# EasyEDA Pro project bldc_driver_board_easyeda.eprj

# Schematic Schematic1
Create Date: 2024-05-04; Page Name: P1; Project Name: bldc_driver_board_easyeda; Schematic Name: Schematic1; Update Date: 2024-05-07; Company: EasyEDA.com; Drawn: EasyEDA; Page Size: A4; Part Number: JLCPCB-002; Reviewed: EasyEDA; Version: V0.1
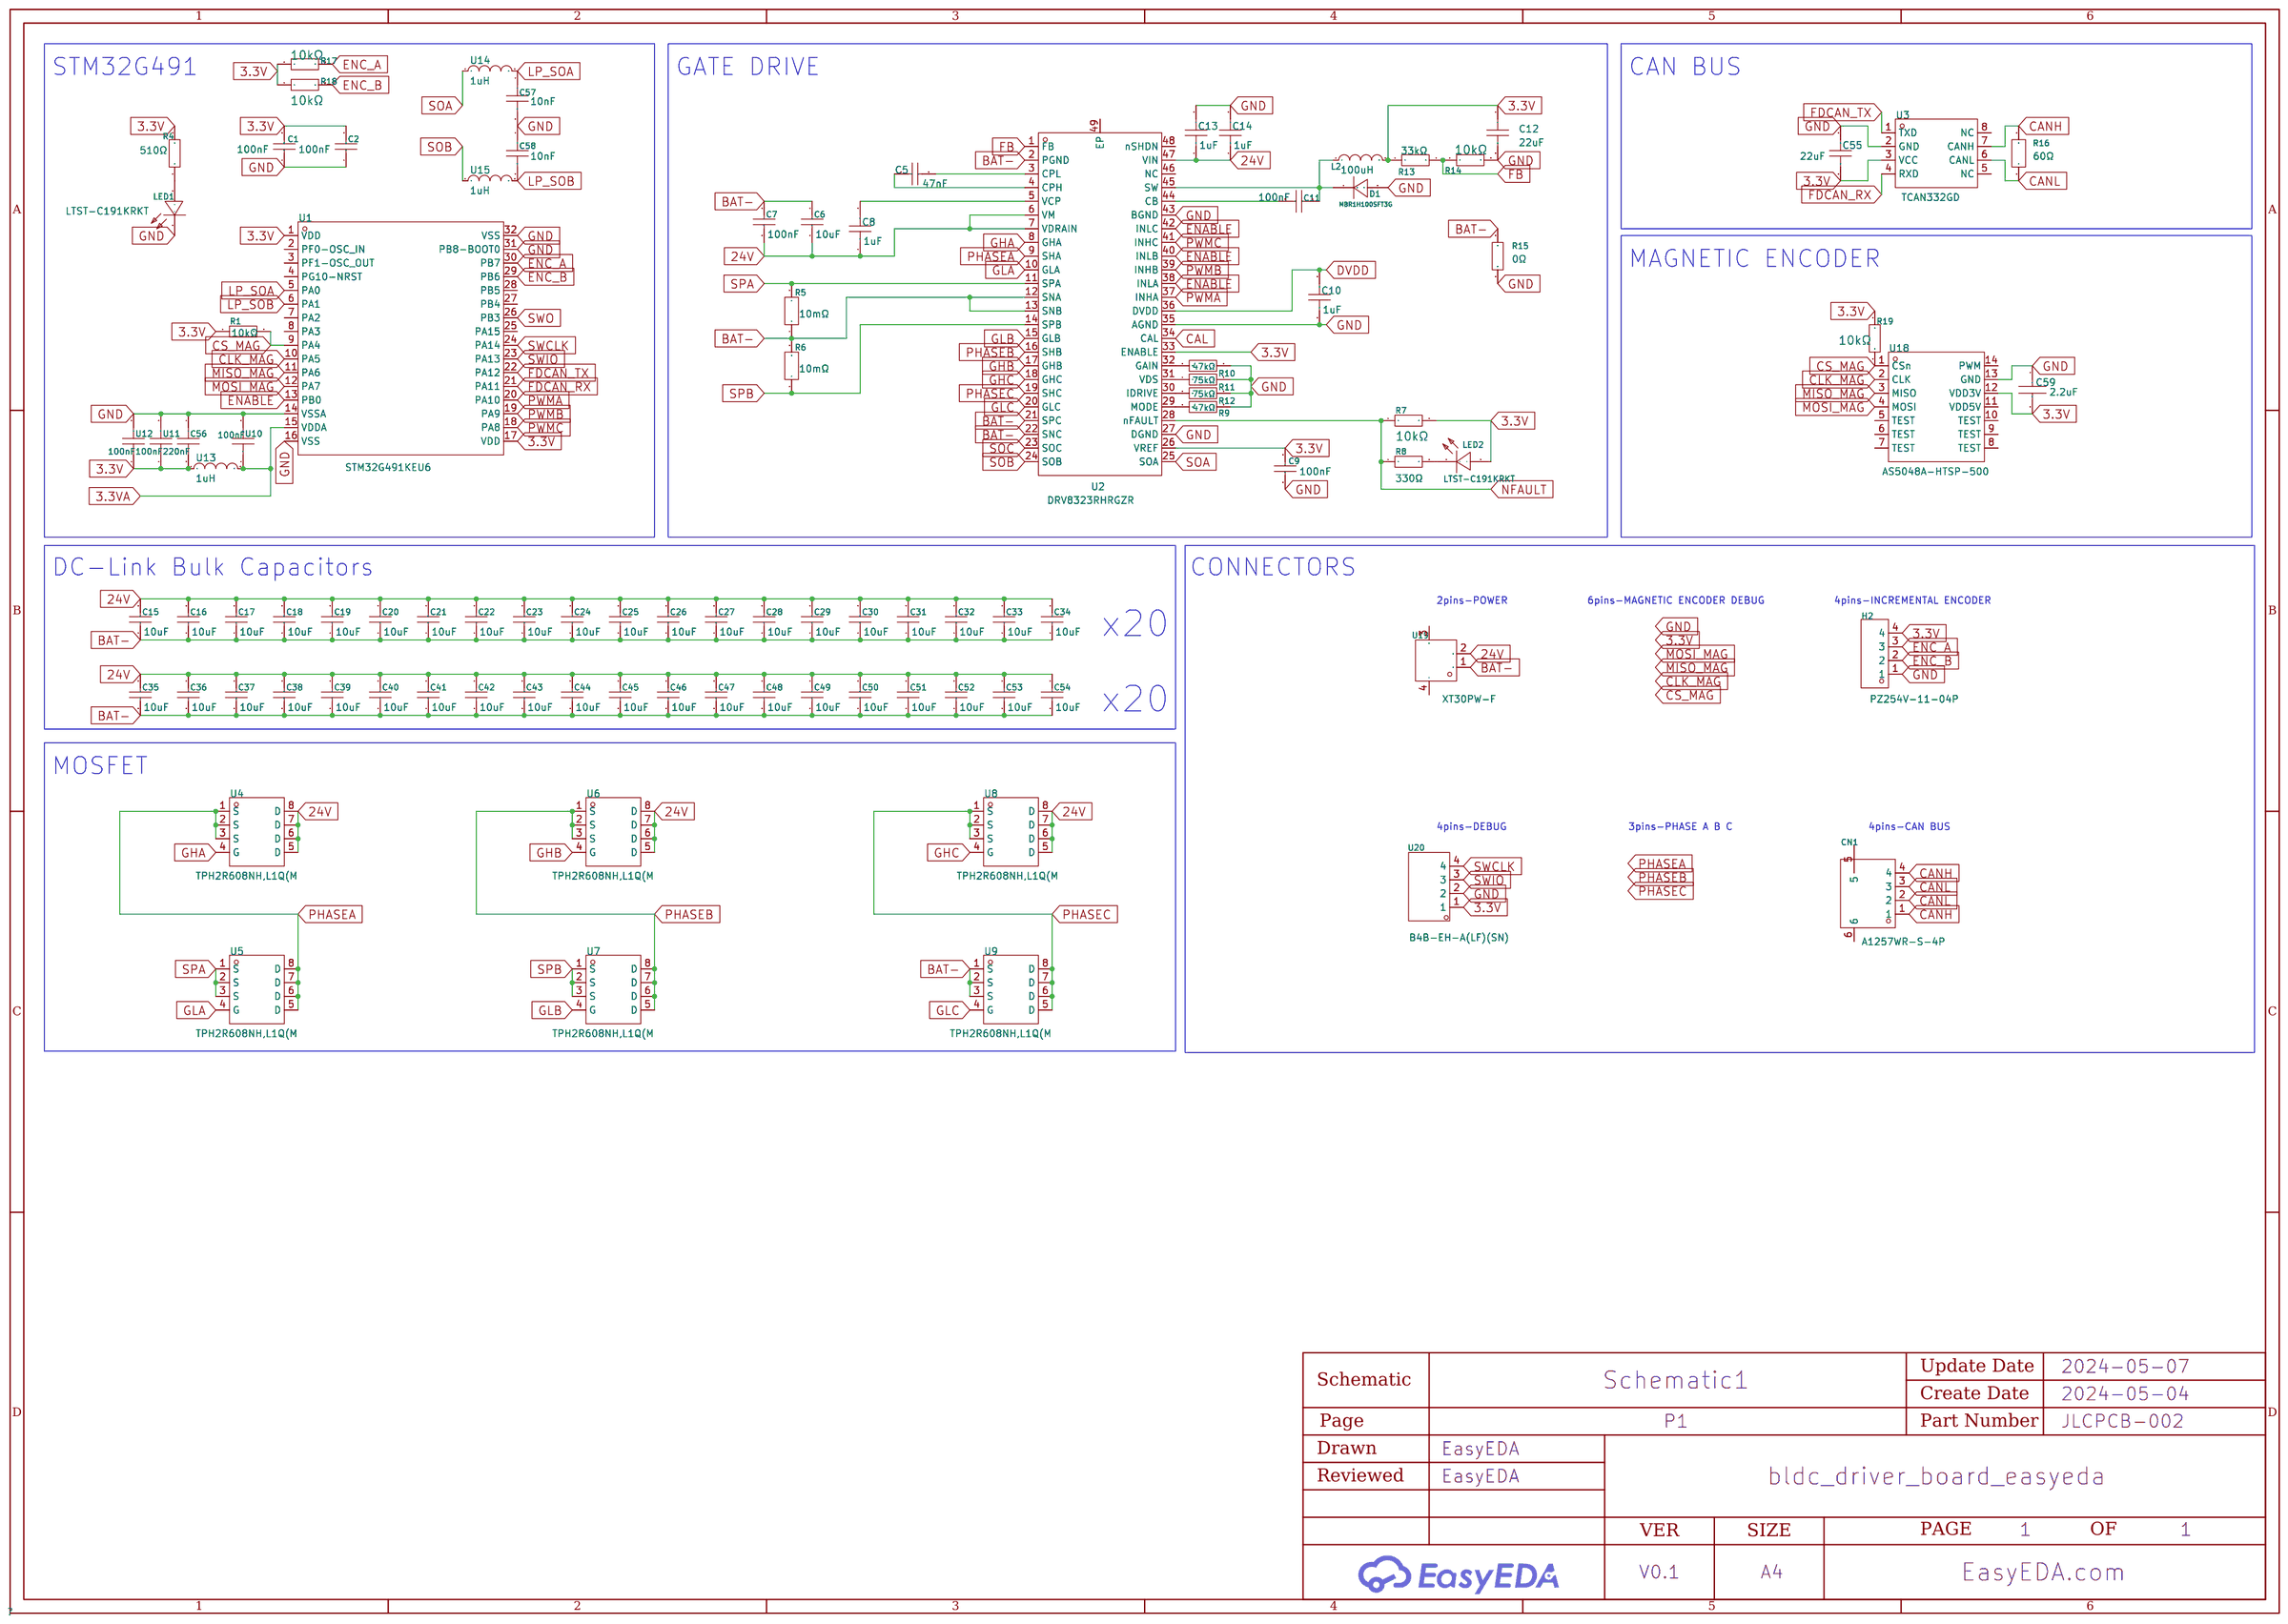
[diagram p0: schematic sheet]

## Parts
C1  100nF  [C0603]
C2  100nF  [C0603]
C5  47nF  [C0805]
C6  10uF  [C1206]
C7  100nF  [C1206]
C8  1uF  [C0603]
C9  100nF  [C0603]
C10  1uF  [C0603]
C11  100nF  [C1206]
C12  22uF  [C0603]
C13  1uF  [C0603]
C14  1uF  [C0603]
C15  10uF  [C1206]
C16  10uF  [C1206]
C17  10uF  [C1206]
C18  10uF  [C1206]
C19  10uF  [C1206]
C20  10uF  [C1206]
C21  10uF  [C1206]
C22  10uF  [C1206]
C23  10uF  [C1206]
C24  10uF  [C1206]
C25  10uF  [C1206]
C26  10uF  [C1206]
C27  10uF  [C1206]
C28  10uF  [C1206]
C29  10uF  [C1206]
C30  10uF  [C1206]
C31  10uF  [C1206]
C32  10uF  [C1206]
C33  10uF  [C1206]
C34  10uF  [C1206]
C35  10uF  [C1206]
C36  10uF  [C1206]
C37  10uF  [C1206]
C38  10uF  [C1206]
C39  10uF  [C1206]
C40  10uF  [C1206]
C41  10uF  [C1206]
C42  10uF  [C1206]
C43  10uF  [C1206]
C44  10uF  [C1206]
C45  10uF  [C1206]
C46  10uF  [C1206]
C47  10uF  [C1206]
C48  10uF  [C1206]
C49  10uF  [C1206]
C50  10uF  [C1206]
C51  10uF  [C1206]
C52  10uF  [C1206]
C53  10uF  [C1206]
C54  10uF  [C1206]
C55  22uF  [C0603]
C56  220nF  [C0201]
C57  10nF  [C01005]
C58  10nF  [C01005]
C59  2.2uF  [C0402]
CN1  A1257WR-S-4P  [CONN-SMD_A1257WR-S-4P]
D1  MBR1H100SFT3G  [SOD-123F_L2.8-W1.8-LS3.7-RD]
H2  PZ254V-11-04P  [HDR-TH_4P-P2.54-V-M]
L2  100uH  [IND-SMD_L4.0-W4.0]
LED1  LTST-C191KRKT  [LED0603-RD]
LED2  LTST-C191KRKT  [LED0603-RD]
R1  10kΩ  [R0603]
R4  510Ω  [R0603]
R5  10mΩ  [RES-SMD_L6.4-W3.2-R2512]
R6  10mΩ  [RES-SMD_L6.4-W3.2-R2512]
R7  10kΩ  [R0603]
R8  330Ω  [R0603]
R9  47kΩ  [R0603]
R10  47kΩ  [R0603]
R11  75kΩ  [R0603]
R12  75kΩ  [R0603]
R13  33kΩ  [R0603]
R14  10kΩ  [R0603]
R15  0Ω  [R1206]
R16  60Ω  [R0603]
R17  10kΩ  [R0603]
R18  10kΩ  [R0603]
R19  10kΩ  [R0603]
U1  STM32G491KEU6  [UFQFPN-32_L5.0-W5.0-P0.50-TL-1]
U2  DRV8323RHRGZR  [VQFN-48_L7.0-W7.0-P0.50-TL-EP5.1]
U3  TCAN332GD  [SOIC-8_L4.9-W3.9-P1.27-LS6.0-BL]
U4  TPH2R608NH,L1Q(M  [POWERVDFN-8_L5.0-W5.0-P1.27-LS6.0-BL]
U5  TPH2R608NH,L1Q(M  [POWERVDFN-8_L5.0-W5.0-P1.27-LS6.0-BL]
U6  TPH2R608NH,L1Q(M  [POWERVDFN-8_L5.0-W5.0-P1.27-LS6.0-BL]
U7  TPH2R608NH,L1Q(M  [POWERVDFN-8_L5.0-W5.0-P1.27-LS6.0-BL]
U8  TPH2R608NH,L1Q(M  [POWERVDFN-8_L5.0-W5.0-P1.27-LS6.0-BL]
U9  TPH2R608NH,L1Q(M  [POWERVDFN-8_L5.0-W5.0-P1.27-LS6.0-BL]
U10  100nF  [C0603]
U11  100nF  [C0603]
U12  100nF  [C0603]
U13  1uH  [L0603]
U14  1uH  [L0603]
U15  1uH  [L0603]
U18  AS5048A-HTSP-500  [TSSOP-14_L5.0-W4.4-P0.65-LS6.4-BL]
U19  XT30PW-F  [CONN-TH_XT30PW-F-1]
U20  B4B-EH-A(LF)(SN)  [CONN-TH_B4B-EH-A-LF-SN]

## Library data of the parts
C1 C2 C9 = CL10B104KO8NNNC: Capacitance: Tolerance:±10% Tolerance:±10% Voltage Rated: Temperature Coefficient:; LCSC Part Name: 100nF ±10% 16V; Supplier Part: C66501; Manufacturer: SAMSUNG(三星); Supplier Footprint: 0603; JLCPCB Part Class: Extended Part; Datasheet: https://atta.szlcsc.com/upload/public/pdf/source/20160218/1457707763339.pdf; Supplier: LCSC; Tolerance: ±10%
C5 = 0805B473K500NT: Capacitance:47nF Tolerance:±10% Tolerance:±10% Voltage Rated: Temperature Coefficient:; LCSC Part Name: 47nF ±10% 50V; Supplier Part: C1745; Manufacturer: FH(风华); Supplier Footprint: 0805; JLCPCB Part Class: Extended Part; Datasheet: https://atta.szlcsc.com/upload/public/pdf/source/20200305/C486355_26A10D38EF8C2A5C37091D0039909270.pdf; Supplier: LCSC; Tolerance: ±10%
C6 C15-C54 = CL31A106KBHNNNE: Capacitance: Tolerance:±10% Tolerance:±10% Voltage Rated: Temperature Coefficient:; LCSC Part Name: 10uF ±10% 50V; Supplier Part: C13585; Manufacturer: SAMSUNG(三星); Supplier Footprint: 1206; JLCPCB Part Class: Basic Part; Datasheet: https://atta.szlcsc.com/upload/public/pdf/source/20160218/1457707763339.pdf; Supplier: LCSC; Tolerance: ±10%
C7 C11 = 1206B104K500NT: Capacitance:100nF Tolerance:±10% Tolerance:±10% Voltage Rated: Temperature Coefficient:; LCSC Part Name: 100nF ±10% 50V; Supplier Part: C110253; Manufacturer: FH(风华); Supplier Footprint: 1206; JLCPCB Part Class: Extended Part; Datasheet: https://atta.szlcsc.com/upload/public/pdf/source/20200305/C486355_26A10D38EF8C2A5C37091D0039909270.pdf; Supplier: LCSC; Tolerance: ±10%
C8 C10 C13 C14 = CL10A105KB8NNNC: Capacitance: Tolerance:±10% Tolerance:±10% Voltage Rated: Temperature Coefficient:; LCSC Part Name: 1uF ±10% 50V; Supplier Part: C15849; Manufacturer: SAMSUNG(三星); Supplier Footprint: 0603; JLCPCB Part Class: Basic Part; Datasheet: https://atta.szlcsc.com/upload/public/pdf/source/20160218/1457707763339.pdf; Supplier: LCSC; Tolerance: ±10%
C12 C55 = CL10A226MQ8NRNE: Capacitance: Tolerance:±20% Tolerance:±20% Voltage Rated: Temperature Coefficient:; LCSC Part Name: 22uF ±20% 6.3V; Supplier Part: C159801; Manufacturer: SAMSUNG(三星); Supplier Footprint: 0603; JLCPCB Part Class: Extended Part; Datasheet: https://atta.szlcsc.com/upload/public/pdf/source/20160218/1457707763339.pdf; Supplier: LCSC; Tolerance: ±20%
C56 = C0603X5R0J224KT00NN: Capacitance: Tolerance:±10% Tolerance:±10% Voltage Rated: Temperature Coefficient:; LCSC Part Name: 220nF ±10% 6.3V; Supplier Part: C338049; Manufacturer: TDK; Supplier Footprint: 0201; JLCPCB Part Class: Extended Part; Datasheet: https://atta.szlcsc.com/upload/public/pdf/source/20190322/C361206_9C300BFAC6DE9FB712DF280041B5B925.pdf; Supplier: LCSC; Tolerance: ±10%
C57 C58 = CC0100KRX5R5BB103: Capacitance: Tolerance:±10% Tolerance:±10% Voltage Rated: Temperature Coefficient:; LCSC Part Name: 10nF ±10% 6.3V; Supplier Part: C326959; Manufacturer: YAGEO(国巨); Supplier Footprint: 01005; JLCPCB Part Class: Extended Part; Datasheet: https://atta.szlcsc.com/upload/public/pdf/source/20181031/C326959_7F573BD42856BB1A942F621CBEE8E6B0.pdf; Supplier: LCSC; Tolerance: ±10%
C59 = CL05A225MQ5NSNC: Capacitance: Tolerance:±20% Tolerance:±20% Voltage Rated: Temperature Coefficient:; LCSC Part Name: 2.2uF ±20% 6.3V; Supplier Part: C12530; Manufacturer: SAMSUNG(三星); Supplier Footprint: 0402; JLCPCB Part Class: Basic Part; Datasheet: https://atta.szlcsc.com/upload/public/pdf/source/20160218/1457707763339.pdf; Supplier: LCSC; Tolerance: ±20%
CN1 = A1257WR-S-4P: Pins Structure:1x4P Pitch:1.25mm Mounting Style:- Reference Series:GH Number of Pins:4P Number of Rows:1 Number of PINs Per Row:4 Row Spacing:- Contact Material:Brass; LCSC Part Name: 系列:GH 间距:1.25mm 1x4P; Supplier Part: C225127; Manufacturer: CJT(长江连接器); Supplier Footprint: SMD,P=1.25mm; JLCPCB Part Class: Extended Part; Datasheet: https://atta.szlcsc.com/upload/public/pdf/source/20181008/C272994_C9E89FA8A36D0009CAD30AD8C59C2782.pdf; Supplier: LCSC; Pins Structure: 1x4P; Pitch: 1.25mm; Reference Series: GH; Number of Pins: 4P; Number of Rows: 1; Number of PINs Per Row: 4; Contact Material: Brass
D1 = MBR1H100SFT3G: Forward Voltage (Vf@If):760mV@1A Reverse Voltage (Vr):100V Average Rectified Current (Io):1A Reverse Leakage Current (Ir):40uA@100V; LCSC Part Name: 电压:100V 电流:1A; Supplier Part: C235757; Manufacturer: onsemi(安森美); Supplier Footprint: SOD-123FL; JLCPCB Part Class: Extended Part; Datasheet: https://atta.szlcsc.com/upload/public/pdf/source/20221020/1153CD973F1751438771FE3485A9D615.pdf; Supplier: LCSC; Forward Voltage (Vf@If): 760mV@1A; Reverse Voltage (Vr): 100V; Average Rectified Current (Io): 1A; Reverse Leakage Current (Ir): 40uA@100V
H2 = PZ254V-11-04P_C492403: Pin Structure:1x4P Pitch:2.54mm Row Spacing:- Circluar Pins/Square Pins:Square Pins Mounting Type:Straight Number of Rows:Plugin Number of Pins:4P Current Rating (Max):- Voltage Rating (Max):- Length of Mating Pin:6mm Insulation Height:2.5mm Length of End; LCSC Part Name: 间距:2.54mm 1x4P 直插 方针; Supplier Part: C492403; Manufacturer: XFCN(兴飞); Supplier Footprint: 插件,P=2.54mm; JLCPCB Part Class: Extended Part; Datasheet: https://atta.szlcsc.com/upload/public/pdf/source/20200309/C492403_F9F19131791D08044AD4F84F8E751A34.pdf; Supplier: LCSC; Pin Structure: 1x4P; Pitch: 2.54mm; Circluar Pins/Square Pins: Square Pins; Mounting Type: Straight; Number of Rows: Plugin; Number of Pins: 4P; Length of Mating Pin: 6mm; Insulation Height: 2.5mm; Length of End Connection Pin: 3mm; Operating Temperature Range: -40℃~+105℃; Color: Black
L2 = ASPIAIG-S4035-101M-T: Inductance:100uH Tolerance:±20% Tolerance:±20% Rated Current: Saturation Current (Isat):750mA DC Resistance (DCR): Ratings:AEC-Q200; LCSC Part Name: 100uH ±20% 750mA; Supplier Part: C1334632; Manufacturer: ABRACON; Supplier Footprint: SMD,4x4mm; JLCPCB Part Class: Extended Part; Datasheet: https://atta.szlcsc.com/upload/public/pdf/source/20210702/86CE89ECC75CFDE29082610D72370976.pdf; Supplier: LCSC; Tolerance: ±20%; Saturation Current (Isat): 750mA; Ratings: AEC-Q200
LED1 LED2 = LTST-C191KRKT: Emitted Color:Red Forward Voltage (VF):2V Forward Voltage (VF):2V Power Dissipation:75mW Forward Current:20mA Dominant Wavelength:631nm Dominant Wavelength:631nm Peak Wavelength:639nm Diode Configuration:- Lens Color:无色透明透镜 Color Temperature:- Color Tempe; LCSC Part Name: 红灯; Supplier Part: C125099; Manufacturer: LITEON(光宝); Supplier Footprint: 0603; JLCPCB Part Class: Extended Part; Datasheet: https://atta.szlcsc.com/upload/public/pdf/source/20180129/C125099_15171878294931315872.pdf; Supplier: LCSC; Emitted Color: Red; Forward Voltage (VF): 2V; Power Dissipation: 75mW; Forward Current: 20mA; Dominant Wavelength: 631nm; Peak Wavelength: 639nm; Lens Color: 无色透明透镜; Luminous Intensity: 54mcd; Viewing Angle: 130°; Operating Temperature: -55℃~+85℃
R1 R7 R14 R17-R19 = 0603WAF1002T5E: Type:Thick Film Resistors Resistance:10kΩ Tolerance:±1% Tolerance:±1% Power(Watts): Overload Voltage (Max): Temperature Coefficient:±100ppm/℃ Temperature Coefficient:±100ppm/℃ Operating Temperature Range:-55℃~+155℃ Operating Temperature Range:-55℃~+155℃; LCSC Part Name: 厚膜电阻 10kΩ ±1% 100mW; Supplier Part: C25804; Manufacturer: UNI-ROYAL(厚声); Supplier Footprint: 0603; JLCPCB Part Class: Basic Part; Datasheet: https://atta.szlcsc.com/upload/public/pdf/source/20200306/C422600_1E6D84923E4A46A82E41ADD87F860B5C.pdf; Supplier: LCSC; Type: Thick Film Resistors; Tolerance: ±1%; Temperature Coefficient: ±100ppm/℃; Operating Temperature Range: -55℃~+155℃
R4 = 0603WAF5100T5E: Type:Thick Film Resistors Resistance: Tolerance:±1% Tolerance:±1% Power(Watts): Overload Voltage (Max): Temperature Coefficient:±100ppm/℃ Temperature Coefficient:±100ppm/℃ Operating Temperature Range:-55℃~+155℃ Operating Temperature Range:-55℃~+155℃; LCSC Part Name: 510Ω ±1% 100mW 厚膜电阻; Supplier Part: C23193; Manufacturer: UNI-ROYAL(厚声); Supplier Footprint: 0603; JLCPCB Part Class: Basic Part; Datasheet: https://atta.szlcsc.com/upload/public/pdf/source/20200306/C422600_1E6D84923E4A46A82E41ADD87F860B5C.pdf; Supplier: LCSC; Type: Thick Film Resistors; Tolerance: ±1%; Temperature Coefficient: ±100ppm/℃; Operating Temperature Range: -55℃~+155℃
R5 R6 = HoJLR2512-3W-10mR-1%: Type:Current Sensing Resistors Resistance:10mΩ Tolerance:±1% Tolerance:±1% Power(Watts): Mounting Sytle:Surface Mount; LCSC Part Name: 10mΩ ±1% 3W; Supplier Part: C2903468; Manufacturer: Milliohm(毫欧); Supplier Footprint: 2512; JLCPCB Part Class: Extended Part; Datasheet: https://atta.szlcsc.com/upload/public/pdf/source/20211009/7525CABAB363C979E942C1DD41F1FEF0.pdf; Supplier: LCSC; Type: Current Sensing Resistors; Tolerance: ±1%; Mounting Sytle: Surface Mount
R8 = 0603WAF3300T5E: Type:Thick Film Resistors Resistance: Tolerance:±1% Tolerance:±1% Power(Watts): Overload Voltage (Max): Temperature Coefficient:±100ppm/℃ Temperature Coefficient:±100ppm/℃ Operating Temperature Range:-55℃~+155℃ Operating Temperature Range:-55℃~+155℃; LCSC Part Name: 330Ω ±1% 100mW 厚膜电阻; Supplier Part: C23138; Manufacturer: UNI-ROYAL(厚声); Supplier Footprint: 0603; JLCPCB Part Class: Basic Part; Datasheet: https://atta.szlcsc.com/upload/public/pdf/source/20200306/C422600_1E6D84923E4A46A82E41ADD87F860B5C.pdf; Supplier: LCSC; Type: Thick Film Resistors; Tolerance: ±1%; Temperature Coefficient: ±100ppm/℃; Operating Temperature Range: -55℃~+155℃
R9 R10 = 0603WAF4702T5E: Type:Thick Film Resistors Resistance:47kΩ Tolerance:±1% Tolerance:±1% Power(Watts): Overload Voltage (Max): Temperature Coefficient:±100ppm/℃ Temperature Coefficient:±100ppm/℃ Operating Temperature Range:-55℃~+155℃ Operating Temperature Range:-55℃~+155℃; LCSC Part Name: 47kΩ ±1% 100mW 厚膜电阻; Supplier Part: C25819; Manufacturer: UNI-ROYAL(厚声); Supplier Footprint: 0603; JLCPCB Part Class: Basic Part; Datasheet: https://atta.szlcsc.com/upload/public/pdf/source/20200306/C422600_1E6D84923E4A46A82E41ADD87F860B5C.pdf; Supplier: LCSC; Type: Thick Film Resistors; Tolerance: ±1%; Temperature Coefficient: ±100ppm/℃; Operating Temperature Range: -55℃~+155℃
R11 R12 = 0603WAF7502T5E: Type:Thick Film Resistors Resistance:75kΩ Tolerance:±1% Tolerance:±1% Power(Watts): Overload Voltage (Max): Temperature Coefficient:±100ppm/℃ Temperature Coefficient:±100ppm/℃ Operating Temperature Range:-55℃~+155℃ Operating Temperature Range:-55℃~+155℃; LCSC Part Name: 75kΩ ±1% 100mW 厚膜电阻; Supplier Part: C23242; Manufacturer: UNI-ROYAL(厚声); Supplier Footprint: 0603; JLCPCB Part Class: Basic Part; Datasheet: https://atta.szlcsc.com/upload/public/pdf/source/20200306/C422600_1E6D84923E4A46A82E41ADD87F860B5C.pdf; Supplier: LCSC; Type: Thick Film Resistors; Tolerance: ±1%; Temperature Coefficient: ±100ppm/℃; Operating Temperature Range: -55℃~+155℃
R13 = 0603WAF3302T5E: Type:Thick Film Resistors Resistance:33kΩ Tolerance:±1% Tolerance:±1% Power(Watts): Overload Voltage (Max): Temperature Coefficient:±100ppm/℃ Temperature Coefficient:±100ppm/℃ Operating Temperature Range:-55℃~+155℃ Operating Temperature Range:-55℃~+155℃; LCSC Part Name: 33kΩ ±1% 100mW 厚膜电阻; Supplier Part: C4216; Manufacturer: UNI-ROYAL(厚声); Supplier Footprint: 0603; JLCPCB Part Class: Basic Part; Datasheet: https://atta.szlcsc.com/upload/public/pdf/source/20200306/C422600_1E6D84923E4A46A82E41ADD87F860B5C.pdf; Supplier: LCSC; Type: Thick Film Resistors; Tolerance: ±1%; Temperature Coefficient: ±100ppm/℃; Operating Temperature Range: -55℃~+155℃
R15 = 1206W4F0000T5E: Type:Thick Film Resistors Resistance: Tolerance:±1% Tolerance:±1% Power(Watts): Overload Voltage (Max): Temperature Coefficient:±800ppm/℃ Temperature Coefficient:±800ppm/℃ Operating Temperature Range:-55℃~+155℃ Operating Temperature Range:-55℃~+155℃; LCSC Part Name: 0Ω ±1% 250mW 厚膜电阻; Supplier Part: C17888; Manufacturer: UNI-ROYAL(厚声); Supplier Footprint: 1206; JLCPCB Part Class: Basic Part; Datasheet: https://atta.szlcsc.com/upload/public/pdf/source/20200306/C422600_1E6D84923E4A46A82E41ADD87F860B5C.pdf; Supplier: LCSC; Type: Thick Film Resistors; Tolerance: ±1%; Temperature Coefficient: ±800ppm/℃; Operating Temperature Range: -55℃~+155℃
R16 = RTT0360R0FTP: Type:Thick Film Resistors Resistance: Tolerance:±1% Tolerance:±1% Power(Watts): Overload Voltage (Max): Temperature Coefficient:±100ppm/℃ Temperature Coefficient:±100ppm/℃ Operating Temperature Range:-55℃~+155℃ Operating Temperature Range:-55℃~+155℃; LCSC Part Name: 厚膜电阻 60Ω ±1% 100mW; Supplier Part: C166918; Manufacturer: RALEC(旺诠); Supplier Footprint: 0603; JLCPCB Part Class: Extended Part; Datasheet: https://atta.szlcsc.com/upload/public/pdf/source/20180928/C303758_52AE496EA05AD4D633595C32F5A0EBAF.pdf; Supplier: LCSC; Type: Thick Film Resistors; Tolerance: ±1%; Temperature Coefficient: ±100ppm/℃; Operating Temperature Range: -55℃~+155℃
U1 = STM32G491KEU6: CPU Core:- Program Storage Size:512KB GPIO Ports Number:26 Operating Voltage Range:1.71V~3.6V Operating Voltage Range:1.71V~3.6V CPU Maximum Speed:170MHz Operating Temperature Range:-40℃~+85℃ Operating Temperature Range:-40℃~+85℃ ADC (Bit):12bit DAC (Bit); Supplier Part: C3225629; Manufacturer: ST(意法半导体); Supplier Footprint: UFQFPN-32(5x5); JLCPCB Part Class: Extended Part; Datasheet: https://atta.szlcsc.com/upload/public/pdf/source/20221107/0005850207A0EC94E09E1AFE17A81C39.pdf; Supplier: LCSC; Program Storage Size: 512KB; GPIO Ports Number: 26; Operating Voltage Range: 1.71V~3.6V; CPU Maximum Speed: 170MHz; Operating Temperature Range: -40℃~+85℃; ADC (Bit): 12bit; DAC (Bit): 12bit; Universal Serial Bus: 有; Watchdog: 有; Infrared Data Association: 有; Low-Voltage Detect: 有; Direct Memory Access: 有; Internal Oscillator: 有
U2 = DRV8323RHRGZR: Supply Voltage:6V~60V Supply Voltage:6V~60V Operating Temperature:-40℃~+125℃@(Ta) Operating Temperature:-40℃~+125℃@(Ta); Supplier Part: C543035; Manufacturer: TI(德州仪器); Supplier Footprint: VQFN-48-EP(7x7); JLCPCB Part Class: Extended Part; Datasheet: https://www.ti.com/cn/lit/gpn/drv8323r; Supplier: LCSC; Supply Voltage: 6V~60V; Operating Temperature: -40℃~+125℃@(Ta)
U3 = TCAN332GD: Type:Transceiver Data Rate:5Mbps Supply Voltage:3V~3.6V Supply Voltage:3V~3.6V Operating Temperature:-40℃~+125℃ Operating Temperature:-40℃~+125℃; Supplier Part: C1545625; Manufacturer: TI(德州仪器); Supplier Footprint: SOIC-8; JLCPCB Part Class: Extended Part; Datasheet: https://www.ti.com/cn/lit/gpn/tcan332; Supplier: LCSC; Type: Transceiver; Data Rate: 5Mbps; Supply Voltage: 3V~3.6V; Operating Temperature: -40℃~+125℃
U4-U9 = TPH2R608NH,L1Q(M: Supplier Part: C5379811; Manufacturer: TOSHIBA(东芝); Supplier Footprint: SOP-8; Datasheet: https://atta.szlcsc.com/upload/public/pdf/source/20230606/A43572E280778E6E932BD69F3356FB0D.pdf; Supplier: LCSC
U10-U12 = 06036D104KAT2A: Capacitance: Tolerance:±10% Tolerance:±10% Voltage Rated: Temperature Coefficient:; LCSC Part Name: 100nF ±10% 6.3V; Supplier Part: C1856510; Manufacturer: Kyocera AVX; Supplier Footprint: 0603; JLCPCB Part Class: Extended Part; Datasheet: https://atta.szlcsc.com/upload/public/pdf/source/20210630/E771284EE21E0F270718F23EFAB9C321.pdf; Supplier: LCSC; Tolerance: ±10%
U13-U15 = YL160808-1R0K: Inductance: Tolerance:±10% Tolerance:±10% Rated Current: Saturation Current (Isat):- DC Resistance (DCR): Q @ Freq:35@10MHz Frequency - Self Resonant: Ratings:; LCSC Part Name: 1uH ±10%; Supplier Part: C2839970; Manufacturer: YJYCOIN(益嘉源); Supplier Footprint: 0603; JLCPCB Part Class: Extended Part; Datasheet: https://atta.szlcsc.com/upload/public/pdf/source/20210615/C2839970_ABC794F14AEDE076178322CDBBF81D48.pdf; Supplier: LCSC; Tolerance: ±10%; Q @ Freq: 35@10MHz
U18 = AS5048A-HTSP-500: Supply Voltage:3V~3.6V；4.5V~5.5V Supply Voltage:3V~3.6V；4.5V~5.5V Rotation Angle:0°~360° Rotation Angle:0°~360°; Supplier Part: C2655181; Manufacturer: ams(艾迈斯半导体); Supplier Footprint: TSSOP-14; JLCPCB Part Class: Extended Part; Datasheet: https://atta.szlcsc.com/upload/public/pdf/source/20210429/095640A91DD735A5214A8BC6EE68F312.pdf; Supplier: LCSC; Supply Voltage: 3V~3.6V；4.5V~5.5V; Rotation Angle: 0°~360°
U19 = XT30PW-F: Brand:艾迈斯 Model:XT30PW-F Power:- Output:- Input:- Size:- Interface:- Type:- Colour:- MaximumCurrent:- Type:航模插头 RatedVoltage:- Type1:- NumberOfUSBHoles:- InterfaceType:母头 MetalMaterial:- InsulationMaterial:- RatedCurrent:- RecommendedWireGauge:- FlameReta; LCSC Part Name: AMASS(艾迈斯)电源连接器 母头 XT30PW-F; Supplier Part: C2913282; Manufacturer: AMASS(艾迈斯); JLCPCB Part Class: Extended Part; Datasheet: https://atta.szlcsc.com/upload/public/pdf/source/20231218/06CFCF98887A9A87638B0856A725C8FD.pdf; Supplier: LCSC; Brand: 艾迈斯; Type: 航模插头; InterfaceType: 母头
U20 = B4B-EH-A(LF)(SN): Pins Structure:1x4P Pitch:2.5mm Mounting Style:- Reference Series:EH Number of Pins:4P Number of Rows:1 Number of PINs Per Row:4 Row Spacing:- Contact Material:Brass; Supplier Part: C160258; Manufacturer: JST; Supplier Footprint: 插件,P=2.5mm; JLCPCB Part Class: Extended Part; Datasheet: https://atta.szlcsc.com/upload/public/pdf/source/20180829/C265103_11C5AD83FCD48B5E904586D0E75EE570.pdf; Supplier: LCSC; Pins Structure: 1x4P; Pitch: 2.5mm; Reference Series: EH; Number of Pins: 4P; Number of Rows: 1; Number of PINs Per Row: 4; Contact Material: Brass

## Nets
3.3V: C1.2 C2.2 C9.2 C12.1 C55.2 C56.2 C59.2 H2.4 L2.2 LED2.2(+) R1.1 R4.2 R7.2 R13.1 R17.1 R18.1 R19.2 U1.1(VDD) U1.17(VDD) U2.26(VREF) U2.33(ENABLE) U3.3(VCC) U11.1 U12.1 U13.1 U18.12(VDD3V) U20.1
3.3VA: U1.15(VDDA) U10.1 U13.2
24V: C6.1 C7.1 C8.1 C13.1 C14.1 C15.2 C16.2 C17.2 C18.2 C19.2 C20.2 C21.2 C22.2 C23.2 C24.2 C25.2 C26.2 C27.2 C28.2 C29.2 C30.2 C31.2 C32.2 C33.2 C34.2 C35.2 C36.2 C37.2 C38.2 C39.2 C40.2 C41.2 C42.2 C43.2 C44.2 C45.2 C46.2 C47.2 C48.2 C49.2 C50.2 C51.2 C52.2 C53.2 C54.2 U2.6(VM) U2.7(VDRAIN) U2.47(VIN) U4.5(D) U4.6(D) U4.7(D) U4.8(D) U6.5(D) U6.6(D) U6.7(D) U6.8(D) U8.5(D) U8.6(D) U8.7(D) U8.8(D) U19.2
DVDD: C10.2 U2.36(DVDD)
GND: C1.1 C2.1 C9.1 C10.1 C12.2 C13.2 C14.2 C55.1 C56.1 C57.2 C58.1 C59.1 D1.2(A) H2.1 LED1.1(-) R9.2 R10.2 R11.2 R12.2 R14.2 R15.1 U1.14(VSSA) U1.16(VSS) U1.31(PB8-BOOT0) U1.32(VSS) U2.27(DGND) U2.35(AGND) U2.43(BGND) U3.2(GND) U10.2 U11.2 U12.2 U18.13(GND) U20.2
BAT-: C6.2 C7.2 C15.1 C16.1 C17.1 C18.1 C19.1 C20.1 C21.1 C22.1 C23.1 C24.1 C25.1 C26.1 C27.1 C28.1 C29.1 C30.1 C31.1 C32.1 C33.1 C34.1 C35.1 C36.1 C37.1 C38.1 C39.1 C40.1 C41.1 C42.1 C43.1 C44.1 C45.1 C46.1 C47.1 C48.1 C49.1 C50.1 C51.1 C52.1 C53.1 C54.1 R5.1 R6.2 R15.2 U2.2(PGND) U2.12(SNA) U2.13(SNB) U2.21(SPC) U2.22(SNC) U9.1(S) U9.2(S) U9.3(S) U19.1
CAL: U2.34(CAL)
CANH: CN1.1 CN1.4 R16.2 U3.7(CANH)
CANL: CN1.2 CN1.3 R16.1 U3.6(CANL)
CLK_MAG: U1.10(PA5) U18.2(CLK)
CS_MAG: R1.2 R19.1 U1.9(PA4) U18.1(CSn)
ENABLE: U1.13(PB0) U2.38(INLA) U2.40(INLB) U2.42(INLC)
ENC_A: H2.3 R17.2 U1.30(PB7)
ENC_B: H2.2 R18.2 U1.29(PB6)
FB: R13.2 R14.1 U2.1(FB)
FDCAN_RX: U1.21(PA11) U3.4(RXD)
FDCAN_TX: U1.22(PA12) U3.1(TXD)
GHA: U2.8(GHA) U4.4(G)
GHB: U2.17(GHB) U6.4(G)
GHC: U2.18(GHC) U8.4(G)
GLA: U2.10(GLA) U5.4(G)
GLB: U2.15(GLB) U7.4(G)
GLC: U2.20(GLC) U9.4(G)
LP_SOA: C57.1 U1.5(PA0) U14.2
LP_SOB: C58.2 U1.6(PA1) U15.2
MISO_MAG: U1.11(PA6) U18.3(MISO)
MOSI_MAG: U1.12(PA7) U18.4(MOSI)
NFAULT: R7.1 R8.1 U2.28(nFAULT)
PHASEA: U2.9(SHA) U4.1(S) U4.2(S) U4.3(S) U5.5(D) U5.6(D) U5.7(D) U5.8(D)
PHASEB: U2.16(SHB) U6.1(S) U6.2(S) U6.3(S) U7.5(D) U7.6(D) U7.7(D) U7.8(D)
PHASEC: U2.19(SHC) U8.1(S) U8.2(S) U8.3(S) U9.5(D) U9.6(D) U9.7(D) U9.8(D)
PWMA: U1.20(PA10) U2.37(INHA)
PWMB: U1.19(PA9) U2.39(INHB)
PWMC: U1.18(PA8) U2.41(INHC)
SOA: U2.25(SOA) U14.1
SOB: U2.24(SOB) U15.1
SOC: U2.23(SOC)
SPA: R5.2 U2.11(SPA) U5.1(S) U5.2(S) U5.3(S)
SPB: R6.1 U2.14(SPB) U7.1(S) U7.2(S) U7.3(S)
SWCLK: U1.24(PA14) U20.4
SWIO: U1.23(PA13) U20.3
SWO: U1.26(PB3)
$1N3020: LED1.2(+) R4.1
$1N3116: C5.2 U2.3(CPL)
$1N3119: C5.1 U2.4(CPH)
$1N3348: C8.2 U2.5(VCP)
$1N4267: LED2.1(-) R8.2
$1N4347: R9.1 U2.29(MODE)
$1N4386: R10.1 U2.32(GAIN)
$1N4470: R11.1 U2.31(VDS)
$1N4546: R12.1 U2.30(IDRIVE)
$1N4795: C11.2 U2.44(CB)
$1N4956: C11.1 D1.1(C) L2.1 U2.45(SW)

Not connected (* = marked no-connect by the designer): CN1 5 6; U1 2(PF0-OSC_IN) 3(PF1-OSC_OUT) 4(PG10-NRST) 7(PA2) 8(PA3) 25(PA15) 27(PB4) 28(PB5); U2 46(NC) 48(nSHDN) 49(EP); U3 5(NC) 8(NC); U18 5(TEST) 6(TEST) 7(TEST) 8(TEST) 9(TEST) 10(TEST) 11(VDD5V) 14(PWM); U19 3 4

## Notes on the sheet
- STM32G491
- GATE DRIVE
- CAN BUS
- MAGNETIC ENCODER
- DC-Link Bulk Capacitors
- CONNECTORS
- 2pins-POWER
- 6pins-MAGNETIC ENCODER DEBUG
- 4pins-INCREMENTAL ENCODER
- x20
- x20
- MOSFET
- 4pins-DEBUG
- 3pins-PHASE A B C
- 4pins-CAN BUS

# Board PCB3
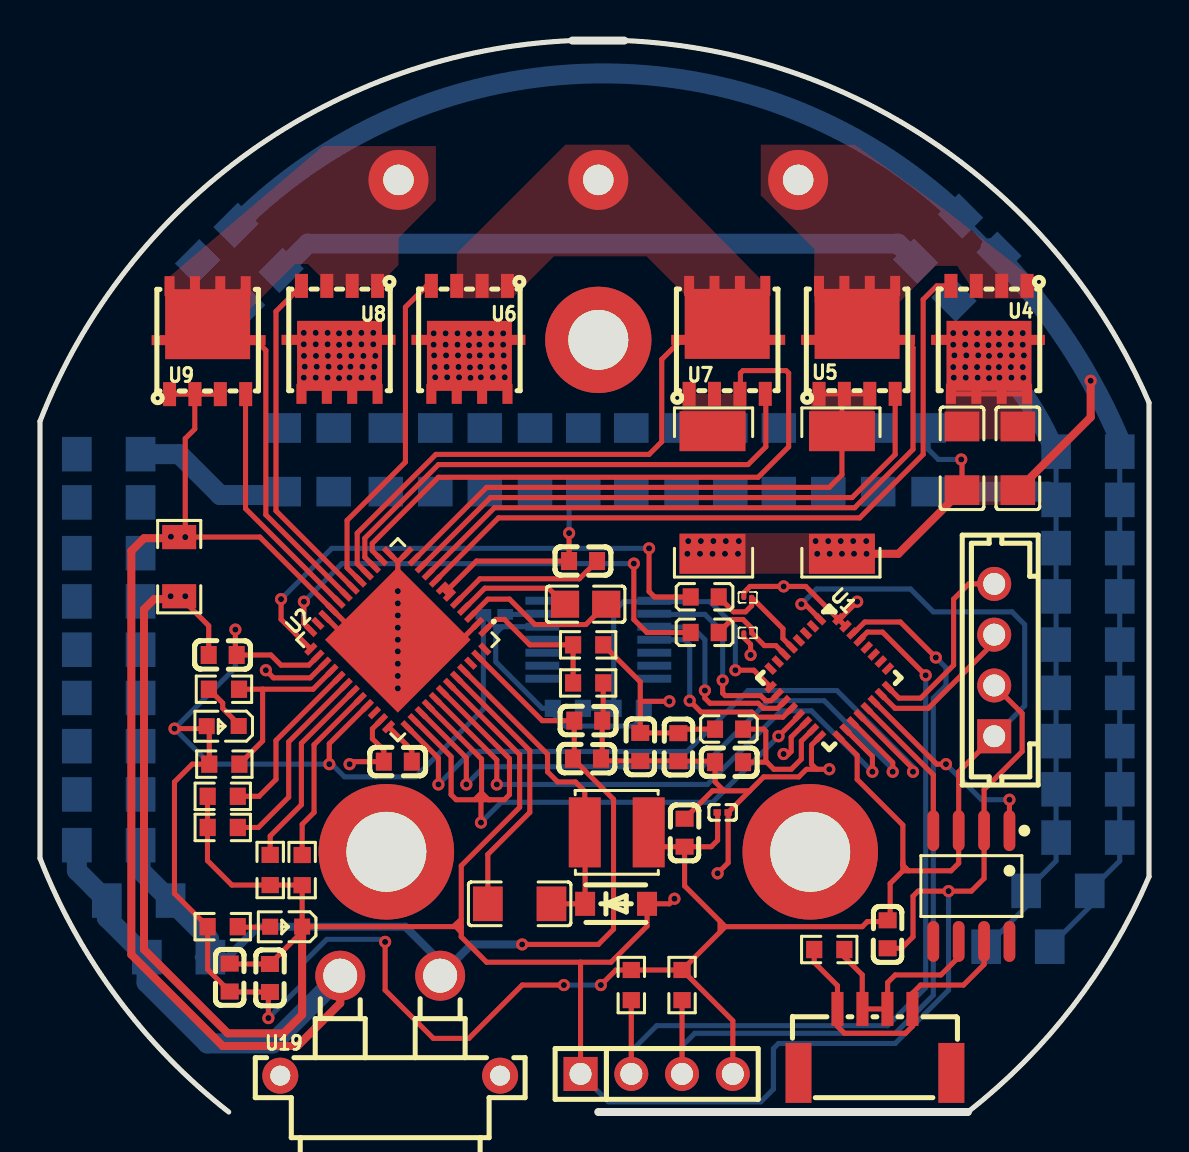
[diagram p1: board, top side]
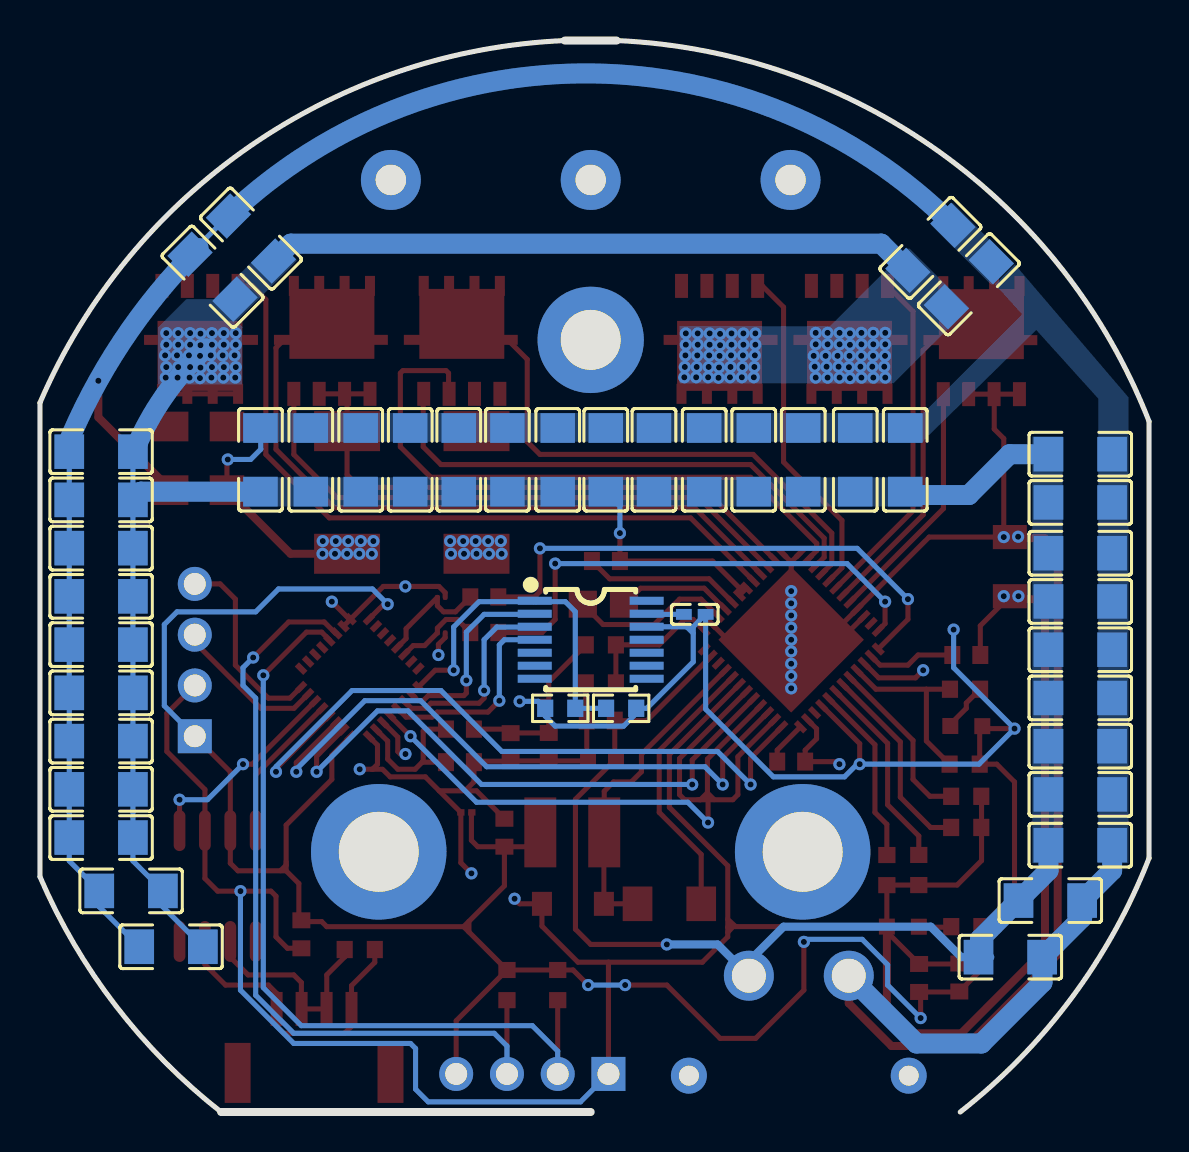
[diagram p2: board, bottom side, seen from below]

Outline 55.5 x 53.62 mm; copper layers: Top Layer, Bottom Layer. Coordinates in mm from the lower left corner of the outline.
Outline path: 26.64,53.59 arc(10.49,48.03) 0,34.55 0,12.7 arc(3.87,5.71) 9.45,0 ; 26.64,53.59 arc(27.94,53.62) 29.24,53.59 ; 26.64,53.59 29.24,53.59 ; 29.24,53.59 arc(44.98,48.32) 55.5,35.48 55.5,11.77 arc(51.71,5.31) 46.43,0 ; 46.43,0 27.94,0 46.43,0
Stack: Top Layer 0.035mm / Dielectric1 1.51mm FR4 er 4.5 / Bottom Layer 0.035mm

## Design rules (mm)
template: JLCPCB Capability(Two Layers Board)
spacing copperThickness1oz (default): track to track 0.102, other pairs 0.152 to 0.3
spacing copperThickness2oz: track to track 0.203, other pairs 0.152 to 0.3
track width copperThickness1oz (default): min 0.127, default 0.254, max 2.54
track width copperThickness2oz: min 0.203, default 0.254, max 2.54
differential pair differentialPair (default): width min 0.127, default 0.254, max 2.54; gap min 0.152, default 0.152
via viaSize (default): diameter min 0.5, default 0.61, max 10; hole min 0.3, default 0.305, max 6.3

## Placement (name value [footprint] x y rotation side)
C1  100nF  [C0603]  9.49 6.73 270 top
C2  100nF  [C0603]  11.51 6.7 270 top
C5  47nF  [C0805]  27.31 25.4 0 top
C6  10uF  [C1206]  46.14 32.7 270 top
C7  100nF  [C1206]  48.93 32.7 270 top
C8  1uF  [C0603]  27.18 27.56 0 top
C9  100nF  [C0603]  9.14 22.86 0 top
C10  1uF  [C0603]  17.91 17.53 0 top
C11  100nF  [C1206]  24 10.41 180 top
C12  22uF  [C0603]  32.26 13.97 90 top
C13  1uF  [C0603]  27.44 19.58 0 top
C14  1uF  [C0603]  27.37 17.67 0 top
C15  10uF  [C1206]  52.44 13.73 180 bottom
C16  10uF  [C1206]  52.44 16.14 180 bottom
C17  10uF  [C1206]  52.44 18.55 180 bottom
C18  10uF  [C1206]  52.44 20.97 180 bottom
C19  10uF  [C1206]  52.44 23.38 180 bottom
C20  10uF  [C1206]  52.44 25.79 180 bottom
C21  10uF  [C1206]  52.44 28.21 180 bottom
C22  10uF  [C1206]  52.44 30.62 180 bottom
C23  10uF  [C1206]  52.44 33.03 180 bottom
C24  10uF  [C1206]  48.94 8.27 180 bottom
C25  10uF  [C1206]  50.94 11.06 180 bottom
C26  10uF  [C1206]  3.44 32.9 0 bottom
C27  10uF  [C1206]  3.44 30.49 0 bottom
C28  10uF  [C1206]  3.44 27.95 0 bottom
C29  10uF  [C1206]  3.44 25.54 0 bottom
C30  10uF  [C1206]  3.44 23.13 0 bottom
C31  10uF  [C1206]  3.44 20.71 0 bottom
C32  10uF  [C1206]  3.44 18.3 0 bottom
C33  10uF  [C1206]  3.44 15.89 0 bottom
C34  10uF  [C1206]  3.44 13.35 0 bottom
C35  10uF  [C1206]  24.77 32.62 270 bottom
C36  10uF  [C1206]  27.19 32.62 270 bottom
C37  10uF  [C1206]  29.59 32.62 270 bottom
C38  10uF  [C1206]  32.11 32.62 270 bottom
C39  10uF  [C1206]  10.94 43.22 315 bottom
C40  10uF  [C1206]  44.46 32.62 270 bottom
C41  10uF  [C1206]  36.97 32.62 270 bottom
C42  10uF  [C1206]  39.45 32.62 270 bottom
C43  10uF  [C1206]  12.2 32.62 270 bottom
C44  10uF  [C1206]  9.02 41.4 315 bottom
C45  10uF  [C1206]  14.7 32.62 270 bottom
C46  10uF  [C1206]  17.3 32.62 270 bottom
C47  10uF  [C1206]  19.78 32.62 270 bottom
C48  10uF  [C1206]  22.26 32.62 270 bottom
C49  10uF  [C1206]  44.94 43.69 225 bottom
C50  10uF  [C1206]  46.86 41.78 225 bottom
C51  10uF  [C1206]  41.95 32.62 270 bottom
C52  10uF  [C1206]  34.54 32.62 270 bottom
C53  10uF  [C1206]  6.94 7.75 0 bottom
C54  10uF  [C1206]  4.94 10.58 0 bottom
C55  22uF  [C0603]  42.42 8.89 90 top
C56  220nF  [C0201]  34.16 14.99 180 top
C57  10nF  [C01005]  35.42 25.74 180 top
C58  10nF  [C01005]  35.42 23.97 0 top
C59  2.2uF  [C0402]  22.73 24.89 180 bottom
CN1  A1257WR-S-4P  [CONN-SMD_A1257WR-S-4P]  41.78 3.56 0 top
D1  MBR1H100SFT3G  [SOD-123F_L2.8-W1.8-LS3.7-RD]  28.83 10.41 0 top
H2  PZ254V-11-04P  [HDR-TH_4P-P2.54-V-M]  30.86 1.91 0 top
L2  100uH  [IND-SMD_L4.0-W4.0]  28.86 13.99 0 top
LED1  LTST-C191KRKT  [LED0603-RD]  12.32 9.27 180 top
LED2  LTST-C191KRKT  [LED0603-RD]  9.14 19.3 180 top
NOREF  -  [Pad_e113]  27.94 38.62 135 top
NOREF#2  -  [Pad_e111]  17.94 46.62 0 top
NOREF#3  -  [Pad_e108]  37.94 46.62 0 top
NOREF#4  -  [Pad_e104]  38.55 13.02 135 top
NOREF#5  -  [Pad_e105]  17.33 13.02 135 top
NOREF#6  -  [Pad_e110]  27.94 46.62 0 top
R1  10kΩ  [R0603]  26.42 20.19 0 bottom
R4  510Ω  [R0603]  9.14 9.27 180 top
R5  10mΩ  [RES-SMD_L6.4-W3.2-R2512]  40.13 30.99 90 top
R6  10mΩ  [RES-SMD_L6.4-W3.2-R2512]  33.66 30.99 270 top
R7  10kΩ  [R0603]  9.23 17.4 180 top
R8  330Ω  [R0603]  9.21 21.15 180 top
R9  47kΩ  [R0603]  9.15 15.79 180 top
R10  47kΩ  [R0603]  13.12 12.1 270 top
R11  75kΩ  [R0603]  11.52 12.11 270 top
R12  75kΩ  [R0603]  9.15 14.23 180 top
R13  33kΩ  [R0603]  27.43 23.37 180 top
R14  10kΩ  [R0603]  27.43 21.46 0 top
R15  0Ω  [R1206]  6.97 27.28 90 top
R16  60Ω  [R0603]  39.5 8.13 180 top
R17  10kΩ  [R0603]  32.13 6.35 270 top
R18  10kΩ  [R0603]  29.59 6.35 270 top
R19  10kΩ  [R0603]  29.46 20.19 0 bottom
U1  STM32G491KEU6  [UFQFPN-32_L5.0-W5.0-P0.50-TL-1]  39.5 21.72 315 top
U2  DRV8323RHRGZR  [VQFN-48_L7.0-W7.0-P0.50-TL-EP5.1]  17.91 23.62 225 top
U3  TCAN332GD  [SOIC-8_L4.9-W3.9-P1.27-LS6.0-BL]  46.61 11.3 180 top
U4  TPH2R608NH,L1Q(M  [POWERVDFN-8_L5.0-W5.0-P1.27-LS6.0-BL]  47.44 38.62 180 top
U5  TPH2R608NH,L1Q(M  [POWERVDFN-8_L5.0-W5.0-P1.27-LS6.0-BL]  40.94 38.62 0 top
U6  TPH2R608NH,L1Q(M  [POWERVDFN-8_L5.0-W5.0-P1.27-LS6.0-BL]  21.44 38.62 180 top
U7  TPH2R608NH,L1Q(M  [POWERVDFN-8_L5.0-W5.0-P1.27-LS6.0-BL]  34.44 38.62 0 top
U8  TPH2R608NH,L1Q(M  [POWERVDFN-8_L5.0-W5.0-P1.27-LS6.0-BL]  14.94 38.62 180 top
U9  TPH2R608NH,L1Q(M  [POWERVDFN-8_L5.0-W5.0-P1.27-LS6.0-BL]  8.44 38.61 0 top
U10  100nF  [C0603]  34.48 17.5 180 top
U11  100nF  [C0603]  31.95 18.25 270 top
U12  100nF  [C0603]  30.04 18.26 270 top
U13  1uH  [L0603]  34.48 19.15 0 top
U14  1uH  [L0603]  33.26 25.76 0 top
U15  1uH  [L0603]  33.26 23.98 0 top
U18  AS5048A-HTSP-500  [TSSOP-14_L5.0-W4.4-P0.65-LS6.4-BL]  27.94 23.62 270 bottom
U19  XT30PW-F  [CONN-TH_XT30PW-F-1]  17.53 4.32 0 top
U20  B4B-EH-A(LF)(SN)  [CONN-TH_B4B-EH-A-LF-SN]  47.75 22.61 90 top

## Footprints (pads in the part's own frame, mm; a bottom-side part is the same pattern mirrored in y, then rotated)
C0201
  rect 0.368x0.324 smd: 1(-0.275,0) 2(0.275,0)
C0402
  rect 0.79x0.54 smd: 1(-0.545,0) 2(0.545,0)
C0603
  rect 0.8x0.9 smd: 1(-0.7,0) 2(0.7,0)
C0805
  rect 1.41x1.35 smd: 1(-1.03,0) 2(1.03,0)
C01005
  rect 0.21x0.22 smd: 1(-0.195,0) 2(0.195,0)
C1206
  rect 1.485x1.728 smd: 1(-1.593,0) 2(1.593,0)
CONN-SMD_A1257WR-S-4P
  rect 0.6x1.7 smd: 1(1.875,1.6) 2(0.625,1.6) 3(-0.625,1.6) 4(-1.875,1.6)
  rect 1.3x3 smd: 5(3.825,-1.6) 6(-3.825,-1.6)
CONN-TH_B4B-EH-A-LF-SN
  rect 1.7x1.7 hole 1.1: 1(-3.81,0)
  round 1.7 hole 1.1: 2(-1.27,0) 3(1.27,0) 4(3.81,0)
CONN-TH_XT30PW-F-1
  round 2.5 hole 1.7: 1(-2.5,2.5) 2(2.5,2.5)
  round 1.8 hole 1: 3(5.5,-2.5) 4(-5.5,-2.5)
HDR-TH_4P-P2.54-V-M
  rect 1.7x1.7 hole 1.1: 1(-3.81,0)
  round 1.7 hole 1.1: 2(-1.27,0) 3(1.27,0) 4(3.81,0)
IND-SMD_L4.0-W4.0
  rect 1.6x3.5 smd: 1(-1.6,0) 2(1.6,0)
L0603
  rect 0.8x0.864 smd: 1(-0.7,0) 2(0.7,0)
LED0603-RD
  rect 0.8x0.8 smd: 1(-0.799,-0.004) 2(0.799,0.004)
Pad_e104
  round 6.78 hole 4: 52(0,0)
Pad_e105
  round 6.78 hole 4: 53(0,0)
Pad_e108
  round 3 hole 1.524: 50(0,0)
Pad_e110
  round 3 hole 1.524: 50(0,0)
Pad_e111
  round 3 hole 1.524: 50(0,0)
Pad_e113
  round 5.32 hole 3: 54(0,0)
POWERVDFN-8_L5.0-W5.0-P1.27-LS6.0-BL
  rect 0.65x1.2 smd: 1(-1.955,-2.7) 2(-0.685,-2.7) 3(0.585,-2.7) 4(1.855,-2.7)
  rect 0.5x1 smd: 5(1.855,2.7) 6(0.585,2.7) 7(-0.685,2.7) 8(-1.955,2.7)
  rect 1x0.5 smd: 8(-2.35,0.001) 8(2.35,0.001)
  rect 4.25x3.5 smd: 8(-0.05,0.8)
R0603
  rect 0.806x0.864 smd: 1(-0.753,0) 2(0.753,0)
R1206
  rect 1.208x1.701 smd: 1(-1.479,0) 2(1.479,0)
RES-SMD_L6.4-W3.2-R2512
  rect 2x3.3 smd: 1(-3.067,0) 2(3.067,0)
SOD-123F_L2.8-W1.8-LS3.7-RD
  rect 1x1.2 smd: 1(-1.55,0) 2(1.55,0)
SOIC-8_L4.9-W3.9-P1.27-LS6.0-BL
  oval 0.588x2.045 smd: 1(-1.905,-2.772) 2(-0.635,-2.772) 3(0.635,-2.772) 4(1.905,-2.772) 5(1.905,2.772) 6(0.635,2.772) 7(-0.635,2.772) 8(-1.905,2.772)
TSSOP-14_L5.0-W4.4-P0.65-LS6.4-BL
  rect 0.4x1.7 smd: 1(-1.95,-2.8) 2(-1.3,-2.8) 3(-0.65,-2.8) 4(0,-2.8) 5(0.65,-2.8) 6(1.3,-2.8) 7(1.95,-2.8) 8(1.95,2.8) 9(1.3,2.8) 10(0.65,2.8) 11(0,2.8) 12(-0.65,2.8) 13(-1.3,2.8) 14(-1.95,2.8)
UFQFPN-32_L5.0-W5.0-P0.50-TL-1
  rect 0.6x0.3 smd: 1(-2.4,1.75) 2(-2.4,1.25) 3(-2.4,0.75) 4(-2.4,0.25) 5(-2.4,-0.25) 6(-2.4,-0.75) 7(-2.4,-1.25) 8(-2.4,-1.75) 17(2.4,-1.75) 18(2.4,-1.25) 19(2.4,-0.75) 20(2.4,-0.25) 21(2.4,0.25) 22(2.4,0.75) 23(2.4,1.25) 24(2.4,1.75)
  rect 0.3x0.6 smd: 9(-1.75,-2.4) 10(-1.25,-2.4) 11(-0.75,-2.4) 12(-0.25,-2.4) 13(0.25,-2.4) 14(0.75,-2.4) 15(1.25,-2.4) 16(1.75,-2.4) 25(1.75,2.4) 26(1.25,2.4) 27(0.75,2.4) 28(0.25,2.4) 29(-0.25,2.4) 30(-0.75,2.4) 31(-1.25,2.4) 32(-1.75,2.4)
VQFN-48_L7.0-W7.0-P0.50-TL-EP5.1
  rect 0.665x0.28 smd: 1(-3.408,2.75) 2(-3.408,2.25) 3(-3.407,1.75) 4(-3.408,1.25) 5(-3.407,0.75) 6(-3.408,0.25) 7(-3.408,-0.25) 8(-3.407,-0.75) 9(-3.408,-1.25) 10(-3.407,-1.75) 11(-3.408,-2.25) 12(-3.408,-2.75) 25(3.408,-2.75) 26(3.408,-2.25) 27(3.407,-1.75) 28(3.408,-1.25) 29(3.407,-0.75) 30(3.408,-0.25) 31(3.408,0.25) 32(3.407,0.75) 33(3.408,1.25) 34(3.407,1.75) 35(3.408,2.25) 36(3.408,2.75)
  rect 0.28x0.665 smd: 13(-2.75,-3.408) 14(-2.25,-3.408) 15(-1.75,-3.407) 16(-1.25,-3.408) 17(-0.75,-3.407) 18(-0.25,-3.408) 19(0.25,-3.408) 20(0.75,-3.407) 21(1.25,-3.408) 22(1.75,-3.407) 23(2.25,-3.408) 24(2.75,-3.408) 37(2.75,3.408) 38(2.25,3.408) 39(1.75,3.407) 40(1.25,3.408) 41(0.75,3.407) 42(0.25,3.408) 43(-0.25,3.408) 44(-0.75,3.407) 45(-1.25,3.408) 46(-1.75,3.407) 47(-2.25,3.408) 48(-2.75,3.408)
  rect 5.15x5.15 smd: 49(0,0)

## Nets
As in the schematic, except:
BAT-: C6.2 C7.2 C15.1 C16.1 C17.1 C18.1 C19.1 C20.1 C21.1 C22.1 C23.1 C24.1 C25.1 C26.1 C27.1 C28.1 C29.1 C30.1 C31.1 C32.1 C33.1 C34.1 C35.1 C36.1 C37.1 C38.1 C39.1 C40.1 C41.1 C42.1 C43.1 C44.1 C45.1 C46.1 C47.1 C48.1 C49.1 C50.1 C51.1 C52.1 C53.1 C54.1 R5.1 R6.2 R15.2 U2.2 U2.12 U2.13 U2.21 U2.22 U2.49 U9.1 U9.2 U9.3 U19.1
PHASEA: NOREF#3.50 U2.9 U4.1 U4.2 U4.3 U5.5 U5.6 U5.7 U5.8
PHASEB: NOREF#6.50 U2.16 U6.1 U6.2 U6.3 U7.5 U7.6 U7.7 U7.8
PHASEC: NOREF#2.50 U2.19 U8.1 U8.2 U8.3 U9.5 U9.6 U9.7 U9.8

Pads without a net: CN1 5 6; NOREF 54; NOREF#4 52; NOREF#5 53; U1 2 3 4 7 8 25 27 28; U2 46 48; U3 5 8; U18 5 6 7 8 9 10 11 14; U19 3 4

## Via types
v1: diameter 0.61, hole 0.305, Top Layer to Bottom Layer, 181 vias

## Routing (per net, layer and track width the routed paths; a pad name or vN(x,y) marks a point on that pad's centre or on a via; arc(x,y) is an arc through that point)
3.3V: length 183
  Top Layer w0.254: 34.03,9.54 34.03,9.02 34.04,9.01 ; 43.18,12.52 43.18,12.35 43.47,12.07 ; C12.1 31.18,13.27 L2.2 ; C12.1 33.59,13.27 33.91,13.59 33.91,14.97 C56.2 ; C12.1 32.26,11.31 34.3,9.27 ; R17.1 34.67,4.56 H2.4 ; R17.1 R18.1 28.82,7.1 v1(28.07,6.35) ; R17.1 34.3,9.27 ; 16.38,20.33 14.48,18.43 v1(14.48,17.4) ; 30.04,20.54 30.04,21.52 R13.1 ; 30.04,20.54 v1(31.5,20.54) ; 30.04,20.54 U12.1 31.93,18.96 U11.1 32.15,19.15 U13.1 ; v1(9.78,24.13) 9.78,22.93 C9.2 11.56,22.86 12.06,22.35 13.45,22.35 U2.26 ; 43.18,12.07 43.18,14.35 40.89,16.64 40.89,17.85 U1.17 ; 43.18,12.07 45.59,12.07 45.97,12.45 U3.3 45.97,17.02 U20.1 ; 43.18,12.07 42.54,11.43 42.54,9.72 C55.2 42.35,9.53 41.4,9.53 41.15,9.27 34.3,9.27 ; v1(26.22,6.35) 24.13,6.35 21.46,3.68 19.69,3.68 17.27,6.1 v1(17.27,8.51) ; v1(6.73,19.18) 8.22,19.18 LED2.2 8.47,19.17 R7.2 7.62,17.4 6.73,16.51 6.73,10.93 R4.2 8.39,7.13 C1.2 9.51,6 C2.2 11.43,5.93 v1(11.43,4.7) ; U1.1 38.29,25.4 v1(38.1,25.4)
  Bottom Layer w0.254: 22.81,23.95 23.11,24.25 23.11,24.27 ; v1(28.07,6.35) v1(26.22,6.35) ; 22.81,24.27 22.81,22.52 25.13,20.19 R1.1 25.66,19.93 26.29,19.3 29.72,19.3 30.22,19.8 R19.2 30.57,20.54 v1(31.5,20.54) ; 22.81,24.27 U18.12 ; 22.81,24.27 C59.2 22.19,20.16 18.8,16.76 15.24,16.76 14.6,17.4 v1(14.48,17.4) 8.51,17.4 v1(6.73,19.18) 9.78,22.23 v1(9.78,24.13) ; v1(17.27,8.51) 17.15,8.64 14.35,8.64 13.08,7.37 13.08,6.35 v1(11.43,4.7) ; v1(38.1,25.4) 38.86,26.16 43.56,26.16 44.7,25.02 48.64,25.02 49.28,24.38 49.28,20.32 U20.1
3.3VA: length 7.7
  Top Layer w0.254: 36.37,17.5 36.72,17.15 37.59,17.15 38.1,17.65 38.1,18.55 U1.15 ; 36.37,17.5 36.32,17.55 36.32,19.05 36.22,19.15 U13.2 ; 36.37,17.5 U10.1
24V: length 143.5
  Top Layer w0.254: 20.49,26.21 20.49,25.85 U2.7 20.49,26.21 ; 20.49,26.21 21.84,27.56 C8.1 v1(26.48,28.96) ; U4.5 U4.6 U4.7 U4.8 ; U2.47 25.13,19.58 C13.1 26.74,17.73 C14.1 28.7,15.64 28.7,9.14 27.94,8.38 v1(24.13,8.38)
  Bottom Layer w0.254: C24.2 49.35,10.27 C25.2 50.85,12.56 C15.2 C16.2 C17.2 C18.2 C19.2 C20.2 C21.2 C22.2 C23.2 ; C36.2 26.48,30.32 v1(26.48,28.96)
  Bottom Layer w0.4: 7.94,7.75 9.4,7.75 10.92,9.27 18.29,9.27 20.03,7.53 U19.2 21.59,8.38 v1(24.13,8.38)
  Bottom Layer w1: C34.2 5.03,12.08 8.45,8.66 8.45,7.75 ; 47.2,38.2 arc(49.28,35.81) 50.8,33.02 ; C39.2 13.4,43.43 42.94,43.43 C49.2 ; C22.2 50.44,31.03 C40.2 ; C43.2 12.03,30.86 9.02,30.86 6.97,32.9 C26.2
  vias: v1(13.2,38.97) v1(13.2,38.4) v1(13.21,37.82) v1(13.25,37.28) v1(13.2,36.73) v1(13.8,38.97) v1(13.8,38.4) v1(13.81,37.82) v1(13.85,37.28) v1(13.8,36.73) v1(14.39,38.97) v1(14.39,38.4) v1(14.41,37.82) v1(14.44,37.28) v1(14.39,36.73) v1(14.97,38.95) v1(14.97,38.38) v1(14.97,36.71) v1(14.99,37.82) v1(15.02,37.26) v1(15.49,38.97) v1(15.49,38.4) v1(15.49,36.73) v1(15.59,37.82) v1(15.54,37.28) v1(16.09,38.97) v1(16.09,38.4) v1(16.09,36.73) v1(16.19,37.82) v1(16.14,37.28) v1(16.68,38.97) v1(16.68,38.4) v1(16.68,36.73) v1(16.78,37.82) v1(16.73,37.28) v1(19.7,38.95) v1(19.7,38.38) v1(19.72,37.85) v1(19.75,37.27) v1(19.78,36.75) v1(20.3,38.95) v1(20.3,38.38) v1(20.32,37.85) v1(20.35,37.27) v1(20.38,36.75) v1(20.89,38.95) v1(20.89,38.38) v1(20.92,37.85) v1(20.94,37.27) v1(20.97,36.75) v1(21.47,38.92) v1(21.47,38.36) v1(21.49,37.82) v1(21.52,37.24) v1(21.54,36.73) v1(21.99,38.95) v1(21.99,38.38) v1(22.01,37.85) v1(22.04,37.27) v1(22.06,36.75) v1(22.59,38.95) v1(22.59,38.38) v1(22.61,37.85) v1(22.64,37.27) v1(22.66,36.75) v1(23.18,38.95) v1(23.18,38.38) v1(23.2,37.85) v1(23.23,37.27) v1(23.26,36.75) v1(45.7,38.96) v1(45.7,38.38) v1(45.76,37.85) v1(45.7,37.26) v1(45.73,36.73) v1(46.3,38.96) v1(46.3,38.38) v1(46.36,37.85) v1(46.3,37.26) v1(46.33,36.73) v1(46.89,38.96) v1(46.89,38.38) v1(46.95,37.85) v1(46.89,37.26) v1(46.92,36.73) v1(47.47,38.94) v1(47.47,38.36) v1(47.47,37.24) v1(47.49,37.82) v1(47.49,36.71) v1(47.99,38.96) v1(47.99,38.38) v1(47.99,37.26) v1(48.04,37.85) v1(48.01,36.73) v1(48.59,38.96) v1(48.59,38.38) v1(48.59,37.26) v1(48.64,37.85) v1(48.61,36.73) v1(49.18,38.96) v1(49.18,38.38) v1(49.18,37.26) v1(49.24,37.85) v1(49.21,36.73)
DVDD: length 2.2
  Top Layer w0.254: C10.2 18.61,18.1 U2.36
GND: length 187.8
  Top Layer w0.254: 20.68,9.27 21.08,9.64 ; 21.08,8.98 20.77,9.32 ; 38.9,17.15 38.4,17.15 ; 20.49,21.39 24,17.88 24,15.24 21.08,12.32 21.08,9.25 ; v1(11.3,22.1) 11.68,21.72 13.53,21.72 U2.27 ; R15.1 8.44,24.32 C9.1 ; v1(31.75,10.67) 31.5,10.41 D1.2 30.38,9.3 28.57,7.49 27.05,7.49 ; C58.1 35.22,23.73 35.56,23.39 v1(35.56,22.86) ; C12.2 33.65,16.07 34.23,16.07 ; 35.52,16.07 36.22,16.76 37.97,16.76 38.35,17.15 ; 35.52,16.07 34.23,16.07 ; 35.52,16.07 C56.1 34.44,12.47 v1(33.91,11.94) ; v1(40.89,25.53) 40.02,24.65 U1.32 ; 34.23,16.07 33.78,16.51 U10.2 33.73,17.55 U11.2 31.93,17.56 U12.2 28.18,17.56 C14.2 28.14,17.73 C13.2 28.19,19.63 R14.2 ; 12.84,9.26 13.12,9.54 R10.2 13.12,11.35 R11.2 9.6,11.35 8.38,12.57 8.38,15.78 R9.2 ; U20.2 49.15,19.94 49.15,18.03 47.24,16.13 U3.2 47.24,11.68 46.61,11.05 v1(45.47,11.05) 43.94,11.05 43.69,10.8 43.69,8.76 43.12,8.19 C55.1 ; 21.08,9.25 21.05,9.27 LED1.1 13.12,9.02 C2.1 9.51,7.4 C1.1 ; 21.08,9.25 21.08,8.76 22.35,7.49 27.05,7.49 ; v1(39.5,17.15) 38.86,17.15 38.61,17.4 38.61,18.35 U1.16 ; U1.32 38.32,26.29 v1(37.21,26.29) 35.53,26.29 35.22,25.98 C57.2 ; U1.32 U1.31 ; 27.05,7.49 H2.1 ; v1(15.49,17.4) 15.62,17.53 C10.1 17.21,18.1 16.64,18.67 16.64,19.17 U2.35 ; v1(37.21,17.91) 37.47,17.91 37.59,18.03 37.59,18.75 U1.14
  Top Layer w0.4: R15.1 6.82,25.65 5.72,25.65 5.21,25.15 5.21,8.13 9.4,3.94 12.19,3.94 13.12,4.86 13.12,9.02
  Bottom Layer w0.254: C59.1 25.11,24.89 U18.13 ; v1(45.47,11.05) 45.47,6.1 42.8,3.43 36.96,3.43 36.7,3.18 36.7,1.14 36.07,0.51 28.45,0.51 H2.1
  vias: v1(6.54,25.8) v1(7.27,25.8)
BAT-: length 193.1
  Top Layer w0.254: U9.1 U9.2 ; U9.2 7.75,35.9 7.75,34.16 7.27,33.69 v1(7.27,28.76) ; U9.2 U9.3 ; 6.98,28.78 R15.2 v1(7.27,28.76) ; C6.2 46.14,32.6 v1(46.1,32.64) ; v1(7.27,28.76) 11,28.76 U2.21 16.14,23.62 ; 17.91,27.51 v1(17.91,26.06) v1(17.91,25.44) v1(17.91,24.84) v1(17.91,24.23) v1(17.91,23.62) ; 17.91,27.51 U2.13 ; 17.91,27.51 U2.12 ; 16.14,23.62 15.43,23.62 U2.22 ; 16.14,23.62 v1(17.91,23.62) ; v1(17.91,23.62) 21.09,23.62 U2.2
  Top Layer w0.4: v1(52.58,36.58) 52.58,34.75 C7.2 ; v1(40.13,27.92) v1(40.74,27.92) v1(41.36,27.92) 42.96,27.92 C6.2 ; R15.2 6.91,28.7 5.21,28.7 4.57,28.07 4.57,7.87 9.14,3.3 12.89,3.3 15.03,5.44 U19.1
  Bottom Layer w0.254: 47.99,42.91 46.08,44.82 C49.1 ; C23.1 C22.1 C21.1 C20.1 C19.1 C18.1 C17.1 C16.1 C15.1 54.03,12.56 C25.1 52.53,10.27 C24.1 ; v1(46.1,32.64) 44.96,32.64 44.45,33.15 44.45,34.2 C40.1
  Bottom Layer w1: C34.1 1.85,12.08 C54.1 3.35,9.72 5.33,7.73 ; 5.33,7.73 C53.1 ; 5.33,7.73 5.33,6.48 8.38,3.43 11.64,3.43 U19.1 ; 9.82,44.36 arc(27.85,51.95) 46.07,44.83 ; 47.56,43.21 arc(51.4,38.52) 54.23,33.15
  vias: v1(6.55,28.78) v1(17.91,23.04) v1(17.91,22.42) v1(17.91,21.81) v1(17.91,21.19) v1(32.44,28.56) v1(32.4,27.92) v1(33.07,28.56) v1(33.03,27.92) v1(33.66,27.92) v1(33.7,28.56) v1(34.28,27.92) v1(34.32,28.56) v1(34.97,28.56) v1(34.93,27.92) v1(38.81,28.56) v1(38.89,27.92) v1(39.45,28.56) v1(39.52,27.92) v1(40.07,28.56) v1(40.7,28.56) v1(41.35,28.56)
CANH: length 15.3
  Top Layer w0.254: U3.7 47.24,7.38 46.21,6.35 44.07,6.35 43.66,5.94 CN1.1 43.66,4.29 43.31,3.94 40.26,3.94 39.91,4.29 CN1.4 39.91,6.32 38.74,7.48 R16.2
CANL: length 10.8
  Top Layer w0.254: U3.6 45.97,7.75 45.09,6.86 42.8,6.86 42.42,6.48 42.42,5.17 CN1.2 CN1.3 41.15,5.17 41.15,6.86 40.25,7.76 R16.1
CLK_MAG: length 9.9
  Top Layer w0.254: U1.10 36.59,20.57 36.32,20.57 36.07,20.83 34.29,20.83 34.16,20.96 v1(34.16,21.59)
  Bottom Layer w0.254: U18.2 30.77,24.89 33.27,24.89 34.16,24 v1(34.16,21.59)
CS_MAG: length 17.5
  Top Layer w0.254: U1.9 35.72,22.1 v1(34.8,22.1)
  Bottom Layer w0.254: v1(34.8,22.1) 34.8,24.26 33.53,25.53 30.78,25.53 U18.1 30.69,25.53 29.21,25.53 28.71,25.03 R19.1 R1.2
ENABLE: length 40.4
  Top Layer w0.254: 21.76,15.62 22.1,15.96 22.1,15.97 22.45,15.62 22.54,15.62 ; 22.07,15.62 22.1,15.65 22.1,17.65 19.43,20.32 19.43,20.33 ; 22.07,15.62 v1(22.07,14.48) ; 22.07,15.62 23.24,15.62 23.5,15.88 23.5,17.68 U2.42 ; 22.07,15.62 20.83,15.62 20.57,15.88 20.57,17.77 U2.38 ; v1(36.96,18.8) 37.98,19.82 37.98,19.84
  Bottom Layer w0.254: v1(22.07,14.48) 23.08,15.49 33.66,15.49 v1(36.96,18.8)
ENC_A: length 41.2
  Top Layer w0.254: v1(44.83,22.73) 43.05,24.51 41.28,24.51 40.71,23.94 U1.30 ; R17.2 H2.3
  Bottom Layer w0.254: H2.3 32.13,3.3 32.77,3.94 42.8,3.94 44.7,5.84 44.7,20.7 45.34,21.34 45.34,22.23 v1(44.83,22.73)
ENC_B: length 40.9
  Top Layer w0.254: U1.29 41.02,23.62 41.4,24 42.16,24 v1(44.32,21.84) ; R18.2 29.59,1.91
  Bottom Layer w0.254: v1(44.32,21.84) 44.32,6.22 42.42,4.32 30.86,4.32 29.59,3.05 29.59,1.91
FB: length 7.1
  Top Layer w0.254: R14.1 R13.2 24.51,23.37 23.24,24.64 22.81,24.64 22.26,24.09
FDCAN_RX: length 7.5
  Top Layer w0.254: 41.37,20.2 44.7,16.86 U3.4
FDCAN_TX: length 10.4
  Top Layer w0.254: U3.1 v1(48.51,15.62) ; U1.22 44.88,17.4 v1(45.34,17.4)
  Bottom Layer w0.254: v1(45.34,17.4) 47.12,15.62 v1(48.51,15.62)
GHA: length 36.5
  Top Layer w0.254: U2.8 22.94,29.72 41.02,29.72 44.2,32.89 44.2,40.64 44.88,41.32 U4.4
GHB: length 16.9
  Top Layer w0.254: U2.17 15.37,27.22 15.37,29.59 18.29,32.51 18.29,40.26 19.35,41.32 U6.4
GHC: length 17.2
  Top Layer w0.254: U8.4 11.81,40.05 11.81,30.07 U2.18
GLA: length 29.1
  Top Layer w0.254: 19.08,27.27 22.54,30.73 40.64,30.73 42.79,32.89 U5.4
GLB: length 26.3
  Top Layer w0.254: U7.4 36.32,35.9 36.32,33.27 35.43,32.39 19.94,32.39 16.26,28.7 16.26,27.75 16.73,27.27
GLC: length 12.3
  Top Layer w0.254: U9.4 10.29,35.9 10.29,30.18 U2.20
LP_SOA: length 5.8
  Top Layer w0.254: U14.2 34.71,25.02 35.31,25.02 35.61,25.33 C57.1 37.18,24.17 37.18,23.68 U1.5
LP_SOB: length 4.4
  Top Layer w0.254: U15.2 34.62,24.64 35.18,24.64 35.61,24.2 C58.2 36.25,23.33 36.82,23.33 U1.6
MISO_MAG: length 10.1
  Top Layer w0.254: U1.11 36.91,20.19 36.19,20.19 35.94,20.45 33.53,20.45 33.27,20.7 v1(33.27,21.08)
  Bottom Layer w0.254: U18.3 30.75,24.26 32.64,24.26 33.27,23.62 v1(33.27,21.08)
MOSI_MAG: length 10.3
  Top Layer w0.254: U1.12 37.18,19.75 35.87,19.75 35.62,20.01 33.08,20.01 v1(32.51,20.57)
  Bottom Layer w0.254: v1(32.51,20.57) 32.51,23.37 32.26,23.62 U18.4
NFAULT: length 9.3
  Top Layer w0.254: 11.14,21.15 13.66,21.15 U2.28 ; 11.14,21.15 9.96,21.15 ; 11.14,21.15 11.14,18.56 R7.1
PHASEA: length 32.5
  Top Layer w0.254: U5.8 43.29,38.62 43.69,38.23 43.69,33.15 40.77,30.23 22.74,30.23 19.43,26.92
PHASEB: length 24.9
  Top Layer w0.254: 16.38,26.92 15.88,27.42 15.88,28.96 19.81,32.89 30.48,32.89 31.12,33.53 31.12,37.65 U7.8
PHASEC: length 14.6
  Top Layer w0.254: U9.8 10.79,38.61 11.3,38.1 11.3,29.87 U2.19
PWMA: length 35
  Top Layer w0.254: 41.02,19.84 43.69,17.17 v1(43.69,17.02) ; U2.37 19.94,17.7 v1(19.94,16.38)
  Bottom Layer w0.254: v1(43.69,17.02) 43.69,17.27 39.88,21.08 35.43,21.08 32.38,18.03 21.59,18.03 v1(19.94,16.38)
PWMB: length 32.4
  Top Layer w0.254: v1(21.34,16.38) 21.34,17.72 19.08,19.98 ; U1.19 42.67,17.48 v1(42.67,17.02)
  Bottom Layer w0.254: v1(21.34,16.38) 22.22,17.27 33.15,17.27 36.45,20.57 39.24,20.57 42.67,17.15 v1(42.67,17.02)
PWMC: length 29.8
  Top Layer w0.254: v1(22.86,16.38) 22.86,17.61 U2.41 ; v1(41.66,17.02) 41.66,17.79 U1.18
  Bottom Layer w0.254: v1(22.86,16.38) 33.4,16.38 37.08,20.07 38.61,20.07 v1(41.66,17.02)
SOA: length 26.9
  Top Layer w0.254: U14.1 30.75,25.76 30.48,26.04 v1(30.48,28.19) ; U2.25 12.06,24.65 v1(12.06,25.65)
  Bottom Layer w0.254: v1(12.06,25.65) 14.6,28.19 v1(30.48,28.19)
SOB: length 24.8
  Top Layer w0.254: v1(13.21,25.53) 13.21,24.43 U2.24 ; v1(29.72,27.43) 29.72,24.64 30.37,23.98 U15.1
  Bottom Layer w0.254: v1(29.72,27.43) 15.11,27.43 v1(13.21,25.53)
SPA: length 29.8
  Top Layer w0.254: U5.2 U5.3 ; U5.2 40.13,35.8 R5.2 40.13,31.88 39.5,31.24 22.34,31.24 U2.11 ; U5.2 U5.1
SPB: length 31.1
  Top Layer w0.254: U2.14 16.63,28.08 16.63,28.44 19.94,31.75 35.94,31.75 37.47,33.27 37.47,36.96 37.34,37.08 35.18,37.08 35.05,36.96 35.05,35.95 U7.3
SWCLK: length 9.9
  Top Layer w0.254: U1.24 42.99,20.7 44.07,20.7 45.72,22.35 45.72,25.65 46.48,26.42 U20.4
SWIO: length 7.7
  Top Layer w0.254: U20.3 47.75,23.5 44.45,20.19 42.79,20.19 U1.23
$1N3020: length 1.6
  Top Layer w0.254: 11.39,9.24 9.77,9.24 9.77,9.25
$1N3116: length 8.1
  Top Layer w0.254: C5.2 27.32,24.38 24.76,24.38 23.5,25.65 22.41,25.65 U2.3
$1N3119: length 5.8
  Top Layer w0.254: C5.1 26.25,25.4 25.44,26.2 22.26,26.2 21.46,25.4 21.45,25.4 U2.4
$1N3348: length 7.9
  Top Layer w0.254: C8.2 26.99,26.67 22.02,26.67 20.85,25.5
$1N4267: length 2.5
  Top Layer w0.254: LED2.1 9.94,19.39 9.14,20.19 9.14,20.46 R8.2
$1N4347: length 8.7
  Top Layer w0.254: R9.1 10.97,15.79 11.81,16.64 11.81,18.59 U2.29
$1N4386: length 9
  Top Layer w0.254: U2.32 13.72,18.37 13.72,14.99 13.12,14.39 R10.1
$1N4470: length 9.9
  Top Layer w0.254: U2.31 13.08,18.44 13.08,15.37 11.52,13.81 R11.1
$1N4546: length 10
  Top Layer w0.254: U2.30 12.45,18.51 12.45,15.75 10.93,14.23 R12.1
$1N4795: length 13.7
  Top Layer w0.254: C11.2 22.41,12.89 24.51,14.99 24.51,18.08 20.85,21.74
$1N4956: length 16.4
  Top Layer w0.254: C11.1 D1.1 27.28,13.97 L2.1 27.26,16.04 26.8,16.51 25.91,16.51 25.4,17.02 25.4,17.9 U2.45

## Copper pours and planes (outline as drawn; the poured copper is in the pictures)
24V on Top Layer: 45.33,35.92 49.66,35.92 49.66,33.66 45.33,33.66
24V on Bottom Layer: 9.02,43.18 16.02,43.18 16.02,36.45 9.02,36.45
24V on Bottom Layer: 42.64,43.69 49.59,43.69 49.59,39.24 42.64,39.24
24V on Bottom Layer: 4.32,33.78 5.84,33.78 5.84,12.45 4.32,12.45
24V on Bottom Layer: 11.43,31.75 45.32,31.75 45.32,30.29 11.43,30.29
24V on Bottom Layer: 12.95,39.3 23.5,39.3 23.5,36.45 12.95,36.45
24V on Bottom Layer: 45.39,39.25 49.59,39.25 49.59,36.39 45.39,36.39
GND on Bottom Layer: 6.22,27.18 45.97,27.18 45.97,9.53 10.92,9.53 6.22,14.22
BAT- on Top Layer: 32,28.96 41.78,28.96 41.78,26.92 32,26.92
BAT- on Top Layer: 45.33,31.83 49.7,31.83 49.7,30.36 45.33,30.36
BAT- on Bottom Layer: 6.79,45.47 10.87,45.47 10.87,41.4 6.79,41.4
BAT- on Bottom Layer: 11.29,34.97 45.34,34.97 45.34,33.53 11.29,33.53
BAT- on Bottom Layer: 1.03,42.42 7.71,42.42 7.71,33.84 1.03,33.84
BAT- on Bottom Layer: 1.03,33.84 2.54,33.84 2.54,12.45 1.03,12.45
BAT- on Bottom Layer: 4.74,40.01 11.43,40.01 11.43,33.45 4.74,33.45
PHASEA on Top Layer: 36.07,48.39 49.41,48.39 49.41,40.49 36.07,40.49
PHASEB on Top Layer: 20.85,48.39 36.54,48.39 36.54,40.7 20.85,40.7
PHASEC on Top Layer: 6.48,48.31 19.81,48.31 19.81,40.11 6.48,40.11
SPA on Top Layer: 38.56,35.98 41.7,35.98 41.7,33.46 38.56,33.46
SPB on Top Layer: 32.16,35.92 35.31,35.92 35.31,33.4 32.16,33.4

Small or netless copper shapes (teardrops, artwork), in the pictures only: 1 on Bottom Layer
